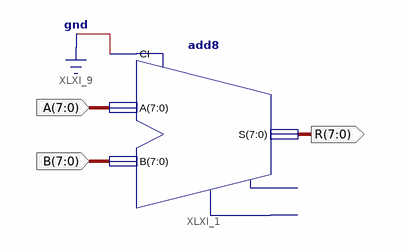
[diagram p0: schematic sheet 1]
// Xilinx ISE schematic Plus.sch (spartan6) as structural Verilog: 1 symbols, 3 ports
module Plus (
  input  [7:0] A,
  input  [7:0] B,
  output [7:0] R
);

  add8 XLXI_1 (.A(A), .B(B), .CI(1'b0), .S(R));  // open: CO, OFL
endmodule
